# Altium schematic sheet Sheet1.SchDoc
size A2; SheetNumber: 1; SheetTotal: 1
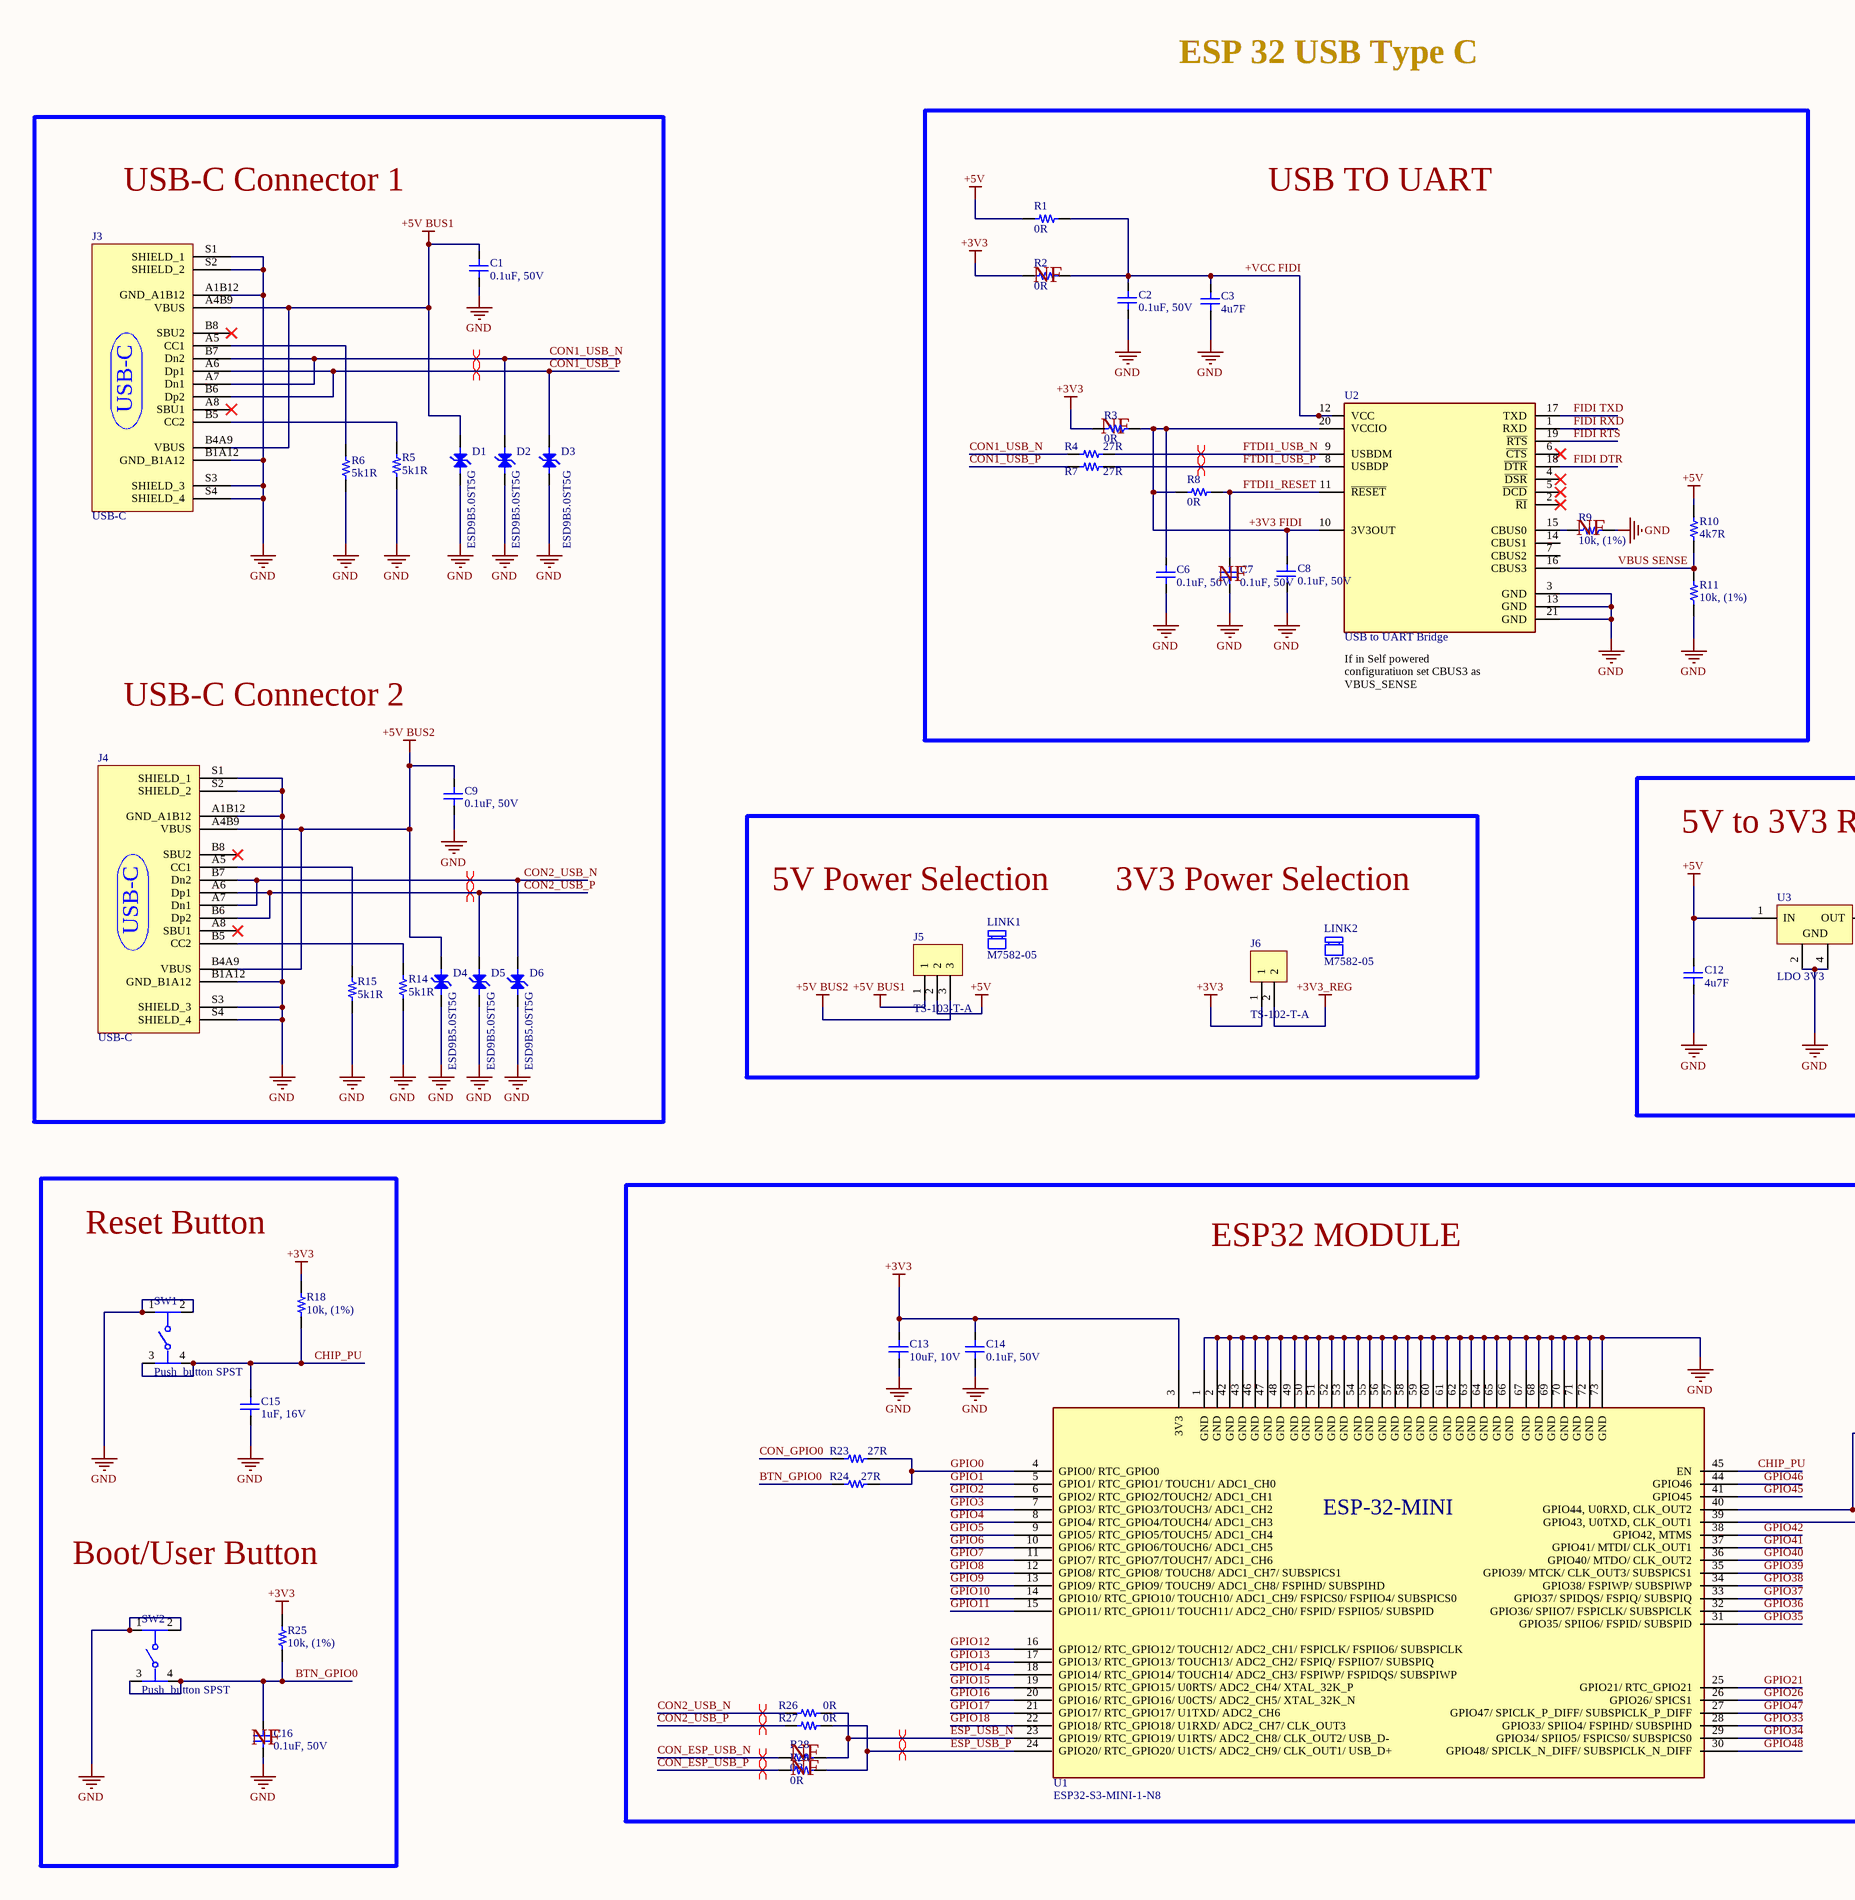
[diagram p0: Sheet1.SchDoc, left]
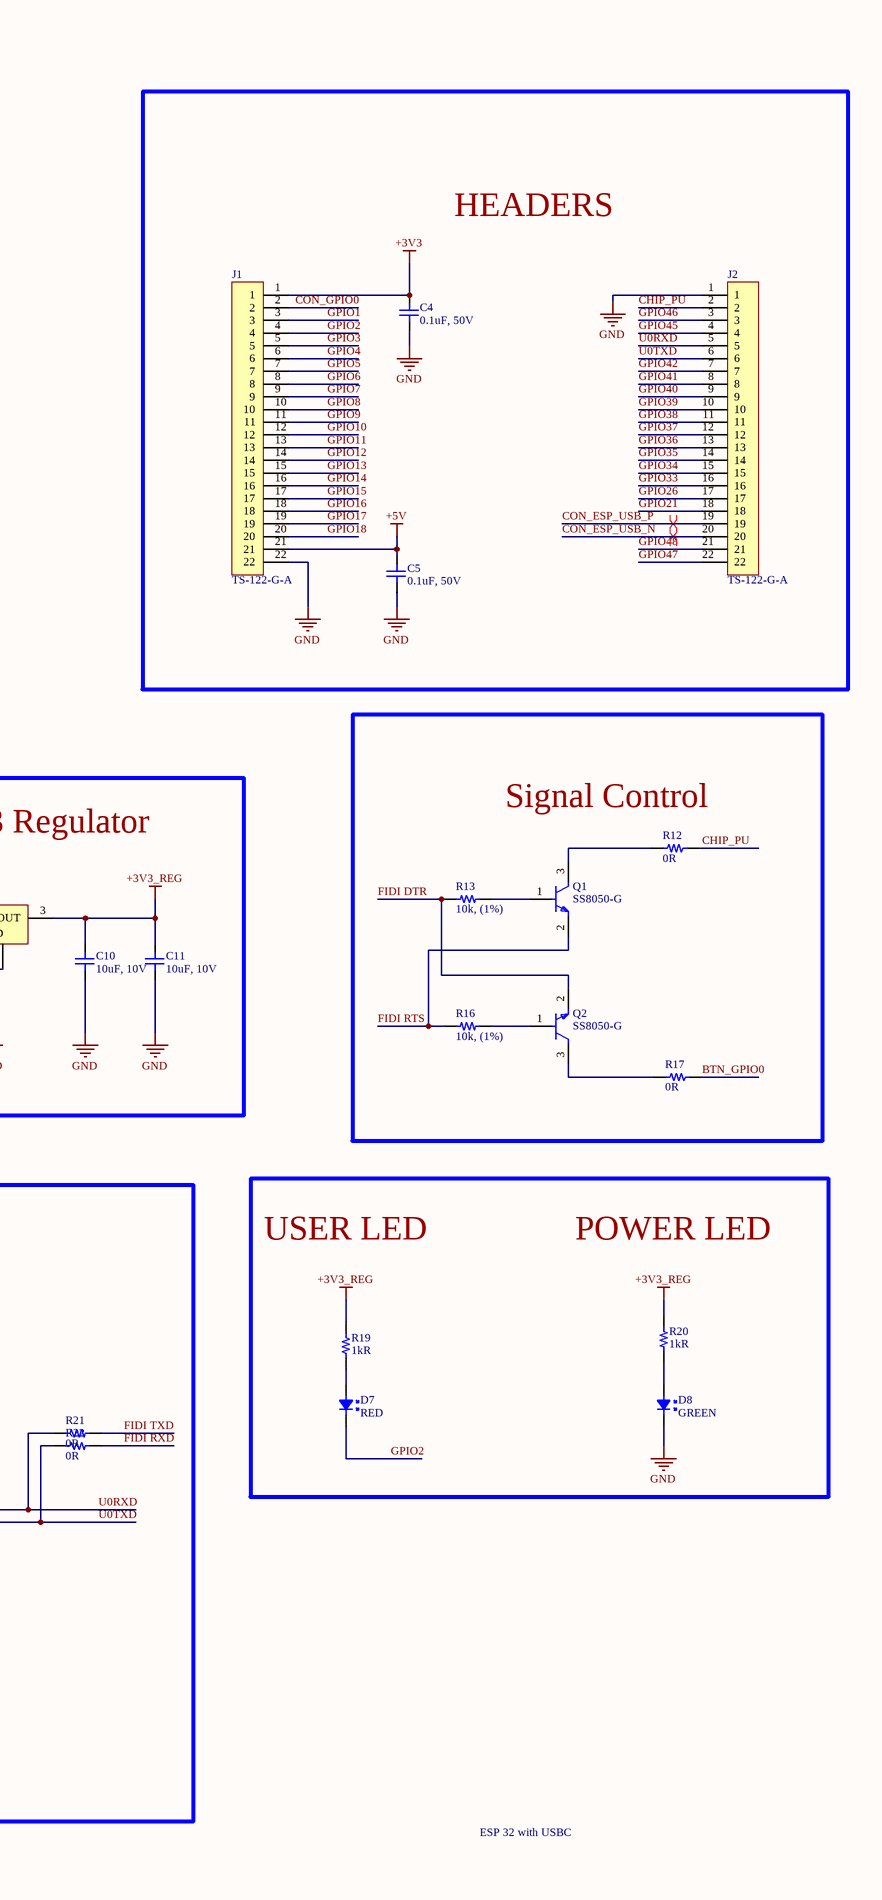
[diagram p1: Sheet1.SchDoc, right]

## Parts
C1  0.1uF, 50V  [FP-CL599-IPC_B]
C2  0.1uF, 50V  [FP-CL599-IPC_B]
C3  4u7F  [FP-CL599-IPC_B]
C4  0.1uF, 50V  [FP-CL599-IPC_B]
C5  0.1uF, 50V  [FP-CL599-IPC_B]
C6  0.1uF, 50V  [FP-CL599-IPC_B]
C7  0.1uF, 50V  [FP-CL599-IPC_B]
C8  0.1uF, 50V  [FP-CL599-IPC_B]
C9  0.1uF, 50V  [FP-CL599-IPC_B]
C10  10uF, 10V  [FP-CL599-IPC_B]
C11  10uF, 10V  [FP-CL599-IPC_B]
C12  4u7F  [FP-CL599-IPC_B]
C13  10uF, 10V  [FP-CL599-IPC_B]
C14  0.1uF, 50V  [FP-CL599-IPC_B]
C15  1uF, 16V  [FP-CL599-IPC_B]
C16  0.1uF, 50V  [FP-CL599-IPC_B]
D1  ESD9B5.0ST5G  [ONSC-SOD-923-2-514AB-01_V]
D2  ESD9B5.0ST5G  [ONSC-SOD-923-2-514AB-01_V]
D3  ESD9B5.0ST5G  [ONSC-SOD-923-2-514AB-01_V]
D4  ESD9B5.0ST5G  [ONSC-SOD-923-2-514AB-01_V]
D5  ESD9B5.0ST5G  [ONSC-SOD-923-2-514AB-01_V]
D6  ESD9B5.0ST5G  [ONSC-SOD-923-2-514AB-01_V]
D7  RED  [LED-RED-0402]
D8  GREEN  [LED-GREEN-0402]
J1  TS-122-G-A  [HDR_1x22_2.54MM]
J2  TS-122-G-A  [HDR_1x22_2.54MM]
J3  USB-C  [FP-2171790001-MFG]
J4  USB-C  [FP-2171790001-MFG]
J5  TS-103-T-A  [HDR_1x3_2.54MM]
J6  TS-102-T-A  [HDR_1x2_2.54MM]
LINK1  M7582-05  (mechanical)
LINK2  M7582-05  (mechanical)
Q1  SS8050-G  [FP-SS8050-G-IPC_B]
Q2  SS8050-G  [FP-SS8050-G-IPC_B]
R1  0R  [RESC1005X40X25NL05T10]
R2  0R  [RESC1005X40X25NL05T10]
R3  0R  [RESC1005X40X25NL05T10]
R4  27R  [RESC1005X40X25NL05T10]
R5  5k1R  [RESC1005X40X25NL05T10]
R6  5k1R  [RESC1005X40X25NL05T10]
R7  27R  [RESC1005X40X25NL05T10]
R8  0R  [RESC1005X40X25NL05T10]
R9  10k, (1%)  [RESC1005X40X25NL05T10]
R10  4k7R  [RESC1005X40X25NL05T10]
R11  10k, (1%)  [RESC1005X40X25NL05T10]
R12  0R  [RESC1005X40X25NL05T10]
R13  10k, (1%)  [RESC1005X40X25NL05T10]
R14  5k1R  [RESC1005X40X25NL05T10]
R15  5k1R  [RESC1005X40X25NL05T10]
R16  10k, (1%)  [RESC1005X40X25NL05T10]
R17  0R  [RESC1005X40X25NL05T10]
R18  10k, (1%)  [RESC1005X40X25NL05T10]
R19  1kR  [RESC1005X40X25NL05T10]
R20  1kR  [RESC1005X40X25NL05T10]
R21  0R  [RESC1005X40X25NL05T10]
R22  0R  [RESC1005X40X25NL05T10]
R23  27R  [RESC1005X40X25NL05T10]
R24  27R  [RESC1005X40X25NL05T10]
R25  10k, (1%)  [RESC1005X40X25NL05T10]
R26  0R  [RESC1005X40X25NL05T10]
R27  0R  [RESC1005X40X25NL05T10]
R28  0R  [RESC1005X40X25NL05T10]
R29  0R  [RESC1005X40X25NL05T10]
SW1  Push  button SPST  [FP-PTS645SH50SMTR92LFS-MFG]
SW2  Push  button SPST  [FP-PTS645SH50SMTR92LFS-MFG]
U1  ESP32-S3-MINI-1-N8  [XCVR_ESP32-S3-MINI-1-N8]
U2  USB to UART Bridge  [FP-QFN-20-IPC_B]
U3  LDO 3V3  [DCY0004A_N]

## Blocks framed on the sheet
USB TO UART: C2 C3 C6-C8 R1-R4 R7-R11 U2
HEADERS: C4 C5 J1 J2
Signal Control: Q1 Q2 R12 R13 R16 R17
5V to 3V3 Regulator: C10-C12 U3
ESP32 MODULE: C13 C14 R21-R24 R26-R29 U1

## Nets
+3V3: C4.2 C13.2 C14.2 J1.1 J6.1 R2.1 R3.1 R18.2 R25.2 U1.3(3V3)
+3V3_REG: C10.2 C11.2 J6.2 R19.2 R20.2 U3.3(OUT)
+5V: C5.2 C12.2 J1.21 J5.2 R1.1 R10.2 U3.1(IN)
+5V BUS1: C1.2 D1.2 J3.A4B9(VBUS) J3.B4A9(VBUS) J5.1
+5V BUS2: C9.2 D4.2 J4.A4B9(VBUS) J4.B4A9(VBUS) J5.3
GND: C1.1 C2.1 C3.1 C4.1 C5.1 C6.1 C7.1 C8.1 C9.1 C10.1 C11.1 C12.1 C13.1 C14.1 C15.1 C16.1 D1.1 D2.1 D3.1 D4.1 D5.1 D6.1 D8.2 J1.22 J2.1 J3.A1B12(GND_A1B12) J3.B1A12(GND_B1A12) J3.S1(SHIELD_1) J3.S2(SHIELD_2) J3.S3(SHIELD_3) J3.S4(SHIELD_4) J4.A1B12(GND_A1B12) J4.B1A12(GND_B1A12) J4.S1(SHIELD_1) J4.S2(SHIELD_2) J4.S3(SHIELD_3) J4.S4(SHIELD_4) R5.1 R6.1 R9.2 R11.1 R14.1 R15.1 SW1.1 SW1.2 SW2.1 SW2.2 U1.1(GND) U1.2(GND) U1.42(GND) U1.43(GND) U1.46(GND) U1.47(GND) U1.48(GND) U1.49(GND) U1.50(GND) U1.51(GND) U1.52(GND) U1.53(GND) U1.54(GND) U1.55(GND) U1.56(GND) U1.57(GND) U1.58(GND) U1.59(GND) U1.60(GND) U1.61(GND) U1.62(GND) U1.63(GND) U1.64(GND) U1.65(GND) U1.66(GND) U1.67(GND) U1.68(GND) U1.69(GND) U1.70(GND) U1.71(GND) U1.72(GND) U1.73(GND) U2.3(GND) U2.13(GND) U2.21(GND) U3.2(GND) U3.4(GND)
+3V3 FIDI: C6.2 C8.2 R3.2 R8.1 U2.10(3V3OUT) U2.20(VCCIO)
+VCC FIDI: C2.2 C3.2 R1.2 R2.2 U2.12(VCC)
BTN_GPIO0: C16.2 R17.2 R24.1 R25.1 SW2.3 SW2.4
CHIP_PU: C15.2 J2.2 R12.2 R18.1 SW1.3 SW1.4 U1.45(EN)
CON1_USB_N: D2.2 J3.A7(Dn1) J3.B7(Dn2) R4.1
CON1_USB_P: D3.2 J3.A6(Dp1) J3.B6(Dp2) R7.1
CON2_USB_N: D6.2 J4.A7(Dn1) J4.B7(Dn2) R26.1
CON2_USB_P: D5.2 J4.A6(Dp1) J4.B6(Dp2) R27.1
CON_ESP_USB_N: J2.20 R28.1
CON_ESP_USB_P: J2.19 R29.1
CON_GPIO0: J1.2 R23.1
ESP_USB_N: R26.2 R28.2 U1.23(GPIO19/_RTC_GPIO19/_U1RTS/_ADC2_CH8/_CLK_OUT2/_USB_D-)
ESP_USB_P: R27.2 R29.2 U1.24(GPIO20/_RTC_GPIO20/_U1CTS/_ADC2_CH9/_CLK_OUT1/_USB_D+)
FIDI DTR: Q2.2(E) R13.1 U2.18(~{DTR})
FIDI RTS: Q1.2(E) R16.1 U2.19(~{RTS})
FIDI RXD: R22.2 U2.1(RXD)
FIDI TXD: R21.2 U2.17(TXD)
FTDI1_RESET: C7.2 R8.2 U2.11(~{RESET})
FTDI1_USB_N: R4.2 U2.9(USBDM)
FTDI1_USB_P: R7.2 U2.8(USBDP)
GPIO0: R23.2 R24.2 U1.4(GPIO0/_RTC_GPIO0)
GPIO1: J1.3 U1.5(GPIO1/_RTC_GPIO1/_TOUCH1/_ADC1_CH0)
GPIO2: D7.2 J1.4 U1.6(GPIO2/_RTC_GPIO2/TOUCH2/_ADC1_CH1)
GPIO3: J1.5 U1.7(GPIO3/_RTC_GPIO3/TOUCH3/_ADC1_CH2)
GPIO4: J1.6 U1.8(GPIO4/_RTC_GPIO4/TOUCH4/_ADC1_CH3)
GPIO5: J1.7 U1.9(GPIO5/_RTC_GPIO5/TOUCH5/_ADC1_CH4)
GPIO6: J1.8 U1.10(GPIO6/_RTC_GPIO6/TOUCH6/_ADC1_CH5)
GPIO7: J1.9 U1.11(GPIO7/_RTC_GPIO7/TOUCH7/_ADC1_CH6)
GPIO8: J1.10 U1.12(GPIO8/_RTC_GPIO8/_TOUCH8/_ADC1_CH7/_SUBSPICS1)
GPIO9: J1.11 U1.13(GPIO9/_RTC_GPIO9/_TOUCH9/_ADC1_CH8/_FSPIHD/_SUBSPIHD)
GPIO10: J1.12 U1.14(GPIO10/_RTC_GPIO10/_TOUCH10/_ADC1_CH9/_FSPICS0/_FSPIIO4/_SUBSPICS0)
GPIO11: J1.13 U1.15(GPIO11/_RTC_GPIO11/_TOUCH11/_ADC2_CH0/_FSPID/_FSPIIO5/_SUBSPID)
GPIO12: J1.14 U1.16(GPIO12/_RTC_GPIO12/_TOUCH12/_ADC2_CH1/_FSPICLK/_FSPIIO6/_SUBSPICLK)
GPIO13: J1.15 U1.17(GPIO13/_RTC_GPIO13/_TOUCH13/_ADC2_CH2/_FSPIQ/_FSPIIO7/_SUBSPIQ)
GPIO14: J1.16 U1.18(GPIO14/_RTC_GPIO14/_TOUCH14/_ADC2_CH3/_FSPIWP/_FSPIDQS/_SUBSPIWP)
GPIO15: J1.17 U1.19(GPIO15/_RTC_GPIO15/_U0RTS/_ADC2_CH4/_XTAL_32K_P)
GPIO16: J1.18 U1.20(GPIO16/_RTC_GPIO16/_U0CTS/_ADC2_CH5/_XTAL_32K_N)
GPIO17: J1.19 U1.21(GPIO17/_RTC_GPIO17/_U1TXD/_ADC2_CH6)
GPIO18: J1.20 U1.22(GPIO18/_RTC_GPIO18/_U1RXD/_ADC2_CH7/_CLK_OUT3)
GPIO21: J2.18 U1.25(GPIO21/_RTC_GPIO21)
GPIO26: J2.17 U1.26(GPIO26/_SPICS1)
GPIO33: J2.16 U1.28(GPIO33/_SPIIO4/_FSPIHD/_SUBSPIHD)
GPIO34: J2.15 U1.29(GPIO34/_SPIIO5/_FSPICS0/_SUBSPICS0)
GPIO35: J2.14 U1.31(GPIO35/_SPIIO6/_FSPID/_SUBSPID)
GPIO36: J2.13 U1.32(GPIO36/_SPIIO7/_FSPICLK/_SUBSPICLK)
GPIO37: J2.12 U1.33(GPIO37/_SPIDQS/_FSPIQ/_SUBSPIQ)
GPIO38: J2.11 U1.34(GPIO38/_FSPIWP/_SUBSPIWP)
GPIO39: J2.10 U1.35(GPIO39/_MTCK/_CLK_OUT3/_SUBSPICS1)
GPIO40: J2.9 U1.36(GPIO40/_MTDO/_CLK_OUT2)
GPIO41: J2.8 U1.37(GPIO41/_MTDI/_CLK_OUT1)
GPIO42: J2.7 U1.38(GPIO42,_MTMS)
GPIO45: J2.4 U1.41(GPIO45)
GPIO46: J2.3 U1.44(GPIO46)
GPIO47: J2.22 U1.27(GPIO47/_SPICLK_P_DIFF/_SUBSPICLK_P_DIFF)
GPIO48: J2.21 U1.30(GPIO48/_SPICLK_N_DIFF/_SUBSPICLK_N_DIFF)
U0RXD: J2.5 R21.1 U1.40(GPIO44,_U0RXD,_CLK_OUT2)
U0TXD: J2.6 R22.1 U1.39(GPIO43,_U0TXD,_CLK_OUT1)
VBUS SENSE: R10.1 R11.2 U2.16(CBUS3)
NetD7_1: D7.1 R19.1
NetD8_1: D8.1 R20.1
NetJ3_A5: J3.A5(CC1) R6.2
NetJ3_B5: J3.B5(CC2) R5.2
NetJ4_A5: J4.A5(CC1) R15.2
NetJ4_B5: J4.B5(CC2) R14.2
NetQ1_1: Q1.1(B) R13.2
NetQ1_3: Q1.3(C) R12.1
NetQ2_1: Q2.1(B) R16.2
NetQ2_3: Q2.3(C) R17.1
NetR9_1: R9.1 U2.15(CBUS0)

Not connected (* = marked no-connect by the designer): J3 A8(SBU1)* B8(SBU2)*; J4 A8(SBU1)* B8(SBU2)*; U2 2(~{RI})* 4(~{DSR})* 5(~{DCD})* 6(~{CTS})* 7(CBUS2) 14(CBUS1)

## Layout directives
differential pair; differential pair class DIFF90: CON1_USB_N, CON1_USB_P, CON2_USB_N, CON2_USB_P, CON_ESP_USB_N, CON_ESP_USB_P, ESP_USB_N, ESP_USB_P, FTDI1_USB_N, FTDI1_USB_P

## Notes on the sheet
- ESP 32 USB Type C
- USB-C Connector 1
- (near R2) NF
- (near R3) NF
- (near R9) NF
- (near C7) NF
- (near U2) If in Self powered configuratiuon set CBUS3 as VBUS_SENSE
- USB-C Connector 2
- (near LINK1) 5V Power Selection
- (near LINK2) 3V3 Power Selection
- Reset Button
- USER LED
- POWER LED
- Boot/User Button
- (near C16) NF
- NF
- ESP 32 with USBC
- (in symbol ESP32-S3-MINI-1-N8) ESP-32-MINI

## Library data of the parts
C1 C2 C4-C9 C14 C16 = CL05B104KB54PNC: 50V 100nF X7R ±10% 0402 Multilayer Ceramic Capacitors MLCC - SMD/SMT ROHS; Manufacturer: Samsung; Material: 4241ConductorMaterial; Supplier: Digikey; Supplier Part Number: 1276-CL05B104KB54PNCCT-ND; Manufacturer Part Number: CL05B104KB54PNC; RoHS: Yes; Category: Ceramic Capacitors; Stock: 1445745; Pricing: 1=0.1, 10=0.03, 100=0.018, 1000=0.01195, 2500=0.01037, 5000=0.00939 (USD); Case/Package: 343Case; Min Operating Temperature: -55°C; Max Operating Temperature: 125°C; Tolerance: 10%; Voltage Rating: 50V; Value: 100nF; Height: 550um; RoHS Compliant: Yes; LCSC part number: C307331
C3 C12 = CL05A475MP5NRNC: Multilayer Ceramic Capacitor, 4.7 uF, 10 V, ï¿½ 20%, X5R, 0402 [1005 Metric]; Manufacturer: Samsung; Material: 4241ConductorMaterial; Value: 4.7uF; Voltage Rating: 10V; Supplier: Digikey; Supplier Part Number: 1276-1482-1-ND; Manufacturer Part Number: CL05A475MP5NRNC; RoHS: Yes; Category: Ceramic Capacitors; Stock: 1513638; Pricing: 1=0.1, 10=0.04, 100=0.0245, 1000=0.01648, 2500=0.01439, 5000=0.01308 (USD); Mounting Technology: Surface Mount; Case/Package: 0402; Case Code (Metric): 1005; Case Code (Imperial): 0402; Min Operating Temperature: -55°C; Max Operating Temperature: 85°C; Packaging: Cut Tape; Tolerance: 20%; Dielectric: X5R; Series: CL; Height: 550um; Lead Free: Lead Free; RoHS Compliant: Yes; ComponentLink1URL: https://datasheet.ciiva.com/25786/cl05a475mp5nrnc-25786963.pdf?src-supplier=Digikey; ComponentLink1Description: https://datasheet.ciiva.com/25786/cl05a475mp5nrnc-25786963.pdf?src-supplier=Digikey; ComponentLink2URL: https://datasheet.ciiva.com/16437/cl05b104kq5nnnc-16437353.pdf?src-supplier=Future+Electronics; ComponentLink2Description: https://datasheet.ciiva.com/16437/cl05b104kq5nnnc-16437353.pdf?src-supplier=Future+Electronics; LCSC Part number: C23733
C10 C11 C13 = CL05A106MP8NUB8: Multilayer Ceramic Capacitor, 10 uF, 10 V, ± 20%, X5R, 0402 [1005 Metric]; Manufacturer: Samsung; Material: 4241ConductorMaterial; Supplier: Digikey; Supplier Part Number: 1276-6830-1-ND; Manufacturer Part Number: CL05A106MP8NUB8; RoHS: Yes; Category: Ceramic Capacitors; Stock: 179131; Pricing: 1=0.31, 10=0.188, 100=0.1251, 1000=0.09037, 2500=0.08106 (USD); Mounting Technology: Surface Mount; Case/Package: 0402; Case Code (Metric): 1005; Case Code (Imperial): 0402; Min Operating Temperature: -55°C; Max Operating Temperature: 85°C; Packaging: Cut Tape; Value: 10uF; Voltage Rating: 10V; Tolerance: 20%; Series: CL; Length: 0.039inch; Width: 0.02inch; Height: 550um; Thickness: 0.035inch; RoHS Compliant: Yes; ComponentLink1URL: http://www.samsungsem.com/kr/support/product-search/mlcc/CL05A106MP8NUB8.jsp?src-supplier=Digikey; ComponentLink1Description: http://www.samsungsem.com/kr/support/product-search/mlcc/CL05A106MP8NUB8.jsp?src-supplier=Digikey; ComponentLink2URL: https://datasheet.octopart.com/CL05A106MP8NUB8-Samsung-Electro-Mechanics-datasheet-136460857.pdf?src-supplier=Future+Electronics; ComponentLink2Description: https://datasheet.octopart.com/CL05A106MP8NUB8-Samsung-Electro-Mechanics-datasheet-136460857.pdf?src-supplier=Future+Electronics; LCSC Part number: CL05A106MP8NUB8
C15 = CL05A105KO5NNNC: 16V 1uF X5R ±10% 0402 Multilayer Ceramic Capacitors MLCC - SMD/SMT ROHS; Manufacturer: Samsung; Material: 4241ConductorMaterial; Supplier: Digikey; Supplier Part Number: 1276-1067-1-ND; Manufacturer Part Number: CL05A105KO5NNNC; RoHS: Yes; Category: Ceramic Capacitors; Stock: 1549627; Pricing: 1=0.1, 10=0.027, 100=0.0163, 1000=0.01076, 2500=0.00932, 5000=0.00843 (USD); Mounting Technology: Surface Mount; Case/Package: 0402; Case Code (Metric): 1005; Case Code (Imperial): 0402; Min Operating Temperature: -55°C; Max Operating Temperature: 85°C; Packaging: Tape and Reel; Package Quantity: 1; Voltage Rating: 16V; Series: CL; Value: 1uF; Tolerance: 10%; Dielectric: X5R; Voltage: 16V; Construction: Flat; Voltage Rating (DC): 16V; Length: 1mm; Width: 0.02inch; Height: 0.5mm; Thickness: 0.022inch; Depth: 0.5mm; Radiation Hardening: No; RoHS Compliant: Yes; ComponentLink1URL: https://datasheet.ciiva.com/16207/cl05a105ko5nnnc-16207571.pdf?src-supplier=Future+Electronics; ComponentLink1Description: https://datasheet.ciiva.com/16207/cl05a105ko5nnnc-16207571.pdf?src-supplier=Future+Electronics; ComponentLink2URL: https://datasheet.ciiva.com/15195/getdatasheetpartid-355272-15195629.pdf?src-supplier=Verical; ComponentLink2Description: https://datasheet.ciiva.com/15195/getdatasheetpartid-355272-15195629.pdf?src-supplier=Verical; LCSC part number: C29266
D1-D6 = ESD9B5.0ST5G: ESD Suppressor TVS Single Bi-Dir ±18kV@Air Gap/±18kV@Contact Disc 2-Pin SOD-923 T/R; Manufacturer: ON Semiconductor; Direction: Bidirectional; Number of Bidirectional Channels: 1; Reverse Standoff Voltage: 5V; Min Breakdown Voltage: 5.8V; Power Line Protection: No; Peak Pulse Current: 1A; Diode Type: ZENER; Value: 15pF; Clamping Voltage: 12.5V; Max Power Dissipation: 300mW; Leakage Current: 1uA; Test Current: 1mA; ESD Protection: Yes; Max Breakdown Voltage: 7.8V; Supplier: Digikey; Supplier Part Number: ESD9B5.0ST5GOSCT-ND; Manufacturer Part Number: ESD9B5.0ST5G; RoHS: Yes; Category: ESD and Circuit Protection ICs; Stock: 1217500; Pricing: 1=0.1, 10=0.071, 100=0.033, 500=0.031, 1000=0.029 (USD); Case/Package: SOD-923-2; Pins: 2; Min Operating Temperature: -55°C; Max Operating Temperature: 150°C; Packaging: Tape and Reel; Number of Lines: 1; Series: Automotive, AEC-Q101; Reverse Breakdown Voltage: 5.8V; Number of Channels: 1; Number of Elements: 1; Package Quantity: 1; Operating Supply Voltage: 5V; Max Surge Current: 1A; Breakdown Voltage: 5.8V; Polarity: Bidirectional; Termination: SMD/SMT; Working Voltage: 5V; Peak Pulse Power: 300mW; Max Reverse Leakage Current: 1uA; Clamping Voltage-Max: 12.5V; Length: 0.8mm; Width: 0.65mm; Height: 0.4mm; Depth: 0.6mm; Radiation Hardening: No; Lead Free: Lead Free; Halogen Free: Halogen Free; RoHS Compliant: Yes; Reach SVHC Compliant: No; ComponentLink1URL: https://datasheet.ciiva.com/1219/1596367-1219274.pdf?src-supplier=Newark; ComponentLink1Description: https://datasheet.ciiva.com/1219/1596367-1219274.pdf?src-supplier=Newark; LCSC Part Number: C316040
D7 = VLMS1500-GS08: LED RED 0402 SMD; Manufacturer: Vishay; Viewing Angle: 130°; Forward Current: 30mA; Forward Voltage: 2V; Luminous Intensity: 54mcd; Dominant Wavelength: 631nm; Test Current: 20mA; Lens Style: Flat,Rectangular,Square; Number of LEDs: 1; Power Rating: 75mW; Lens Size: 0.5mm; Supplier: Digikey; Supplier Part Number: VLMS1500-GS08CT-ND; Manufacturer Part Number: VLMS1500-GS08; RoHS: Yes; Category: LEDs; Stock: 72955; Pricing: 1=0.33, 10=0.189, 100=0.1166, 500=0.08838, 1000=0.07977 (USD); Mounting Technology: Surface Mount; Case/Package: 0402; Pins: 2; Color: Red; Case Code (Metric): 1005; Case Code (Imperial): 0402; Min Operating Temperature: -30°C; Max Operating Temperature: 85°C; Package Quantity: 9000; Packaging: Tape and Reel; Illumination Color: Red; Wavelength: 631nm; Series: CHipLED; Length: 1mm; Width: 0.5mm; Height: 0.55mm; Radiation Hardening: No; Lead Free: Lead Free; RoHS Compliant: Yes; Reach SVHC Compliant: Unknown; ComponentLink1URL: http://components.arrow.com/part/dataview/56357384S461524N5680?src-supplier=Arrow+Electronics; ComponentLink1Description: http://components.arrow.com/part/dataview/56357384S461524N5680?src-supplier=Arrow+Electronics; ComponentLink2URL: http://www.mouser.com/ds/2/427/vlmo1500-244705.pdf?src-supplier=Mouser; ComponentLink2Description: http://www.mouser.com/ds/2/427/vlmo1500-244705.pdf?src-supplier=Mouser; ComponentLink3URL: http://www.farnell.com/datasheets/1809983.pdf?src-supplier=Farnell; ComponentLink3Description: http://www.farnell.com/datasheets/1809983.pdf?src-supplier=Farnell; ComponentLink4URL: http://www.alliedelec.com/m/d/cfc385e1097fc985ee9a50a3551ac188.pdf?src-supplier=Allied+Electronics; ComponentLink4Description: http://www.alliedelec.com/m/d/cfc385e1097fc985ee9a50a3551ac188.pdf?src-supplier=Allied+Electronics; ComponentLink5URL: https://datasheet.octopart.com/VLMS1500-GS08-Vishay-datasheet-62332426.pdf?src-supplier=Newark; ComponentLink5Description: https://datasheet.octopart.com/VLMS1500-GS08-Vishay-datasheet-62332426.pdf?src-supplier=Newark; ComponentLink6URL: http://www.vishay.com/docs/82554/vlmo1500.pdf?src-supplier=Avnet; ComponentLink6Description: http://www.vishay.com/docs/82554/vlmo1500.pdf?src-supplier=Avnet; ComponentLink7URL: https://datasheet.octopart.com/VLMS1500-GS08-Vishay-datasheet-21227148.pdf?src-supplier=Future+Electronics; ComponentLink7Description: https://datasheet.octopart.com/VLMS1500-GS08-Vishay-datasheet-21227148.pdf?src-supplier=Future+Electronics; ComponentLink8URL: http://www.farnell.com/datasheets/2050839.pdf?src-supplier=Newark; ComponentLink8Description: http://www.farnell.com/datasheets/2050839.pdf?src-supplier=Newark; ComponentLink9URL: http://www.farnell.com/datasheets/1809983.pdf?src-supplier=Element14; ComponentLink9Description: http://www.farnell.com/datasheets/1809983.pdf?src-supplier=Element14; ComponentLink10URL: https://datasheet.octopart.com/VLMS1500-GS08-Vishay-datasheet-33014519.pdf?src-supplier=Element14; ComponentLink10Description: https://datasheet.octopart.com/VLMS1500-GS08-Vishay-datasheet-33014519.pdf?src-supplier=Element14; ComponentLink11URL: http://www.farnell.com/datasheets/1809983.pdf?src-supplier=Newark; ComponentLink11Description: http://www.farnell.com/datasheets/1809983.pdf?src-supplier=Newark; ComponentLink12URL: http://datasheet.octopart.com/VLMS1500-GS08-Vishay-datasheet-21227148.pdf?src-supplier=Avnet; ComponentLink12Description: http://datasheet.octopart.com/VLMS1500-GS08-Vishay-datasheet-21227148.pdf?src-supplier=Avnet; ComponentLink13URL: http://datasheet.octopart.com/VLMS1500-GS08-Vishay-datasheet-21227148.pdf?src-supplier=LCSC; ComponentLink13Description: http://datasheet.octopart.com/VLMS1500-GS08-Vishay-datasheet-21227148.pdf?src-supplier=LCSC; ComponentLink14URL: http://datasheet.octopart.com/VLMS1500-GS08-Vishay-datasheet-21227148.pdf?src-supplier=Quest; ComponentLink14Description: http://datasheet.octopart.com/VLMS1500-GS08-Vishay-datasheet-21227148.pdf?src-supplier=Quest; ComponentLink15URL: http://datasheet.octopart.com/VLMS1500-GS08-Vishay-datasheet-21227148.pdf?src-supplier=NAC+Semi; ComponentLink15Description: http://datasheet.octopart.com/VLMS1500-GS08-Vishay-datasheet-21227148.pdf?src-supplier=NAC+Semi; LCSC Part Number: C511370
D8 = VLMTG1500-GS08: LED GREEN 0402 SMD; Manufacturer: Vishay; Viewing Angle: 65°; Supplier: Digikey; Supplier Part Number: 751-VLMTG1500-GS08DKR-ND; Manufacturer Part Number: VLMTG1500-GS08; RoHS: Yes; Category: LEDs; Stock: 2572; Pricing: 1=0.43, 10=0.249, 100=0.1568, 500=0.12086, 1000=0.10985 (USD); RoHS Compliant: Yes; LCSC Part Number: C20346084
J1 J2 = TS-122-G-A: 22 Position Header Connector Post Gold; Manufacturer: Samtec; Supplier: Mouser; Supplier Part Number: 200-TS122GA; Manufacturer Part Number: TS-122-G-A; RoHS: Yes; Category: Connectors; Stock: 20; Pricing: 1=5.24, 10=5.24, 50=5.24, 100=4.19, 1000=3.03, 10000=2.45 (USD); ComponentLink1URL: https://datasheet.ciiva.com/410/tx-1xx-x-x-mkt1-410311.pdf?src-supplier=Digikey; ComponentLink1Description: https://datasheet.ciiva.com/410/tx-1xx-x-x-mkt1-410311.pdf?src-supplier=Digikey; LCSC Part number: C7125323
J3 J4 = 217179-0001: CONN RCP USB2.0 TYP C 24P SMD RA; Manufacturer: Molex; Current Rating: 1.25A; Gender: Receptacle; Number of Contacts: 16; Voltage Rating: 30V; Supplier: Digikey; Supplier Part Number: 900-2171790001CT-ND; Manufacturer Part Number: 217179-0001; RoHS: No; Category: Connectors; Stock: 2736; Pricing: 1=0.79, 10=0.645, 25=0.5948, 50=0.5594, 100=0.5259, 250=0.48484, 500=0.45592 (USD); Contact Material: Nickel,Gold; Min Operating Temperature: -40°C; Max Operating Temperature: 85°C; USB Standard: USB 2.0; Height: 3.36mm; LCSC Part number: C2894899
J5 = TS-103-T-A: CONN HEADER VERT 3POS 2.54MM; Manufacturer: Samtec; Supplier: Digikey; Supplier Part Number: SAM1112-03-ND; Manufacturer Part Number: TS-103-T-A; RoHS: Yes; Category: Connectors; Stock: 9448; Pricing: 1=0.9, 10=0.734, 100=0.5984, 500=0.51874, 1000=0.48782, 5000=0.42299, 10000=0.42149 (USD); ComponentLink1URL: https://datasheet.ciiva.com/410/tx-1xx-x-x-mkt1-410199.pdf?src-supplier=Digikey; ComponentLink1Description: https://datasheet.ciiva.com/410/tx-1xx-x-x-mkt1-410199.pdf?src-supplier=Digikey; LCSC Part number: C6338633
J6 = TS-102-T-A: CONN HEADER VERT 2POS 2.54MM; Manufacturer: Samtec; Gender: 29Gender; Supplier: Digikey; Supplier Part Number: SAM1112-02-ND; Manufacturer Part Number: TS-102-T-A; RoHS: Yes; Category: Headers and Wire Housings; Stock: 6682; Pricing: 1=0.71, 10=0.575, 100=0.4687, 500=0.4063, 1000=0.38208, 5000=0.3313, 10000=0.32266 (USD); Width: 2.54mm; Lead Free: 5697LeadFree; ComponentLink1URL: https://datasheet.ciiva.com/410/tx-1xx-x-x-mkt1-410198.pdf?src-supplier=Digikey; ComponentLink1Description: https://datasheet.ciiva.com/410/tx-1xx-x-x-mkt1-410198.pdf?src-supplier=Digikey; LCSC Part number: C3337950
LINK1 LINK2 = M7582-05: 2.54mm (0.1") Pitch Open Top Jumper Socket, single use, gold, Black; Manufacturer: Harwin; Max Current Rating: 1A; Contact Resistance: 20mR; Number of Positions: 2; Insulation Resistance: 5GR; Supplier: Digikey; Supplier Part Number: 952-2881-ND; Manufacturer Part Number: M7582-05; RoHS: Yes; Category: Headers and Wire Housings; Stock: 29899; Pricing: 1=0.15, 10=0.124, 25=0.114, 50=0.107, 100=0.1007, 250=0.0928, 500=0.08728, 1000=0.08207, 2500=0.07566 (USD); Contact Material: Bronze; Contact Plating: Gold; Color: Black; Material: Nickel; Plating: Gold; Housing Color: Black; Housing Material: PBT; Min Operating Temperature: -55°C; Max Operating Temperature: 105°C; Package Quantity: 5000; Packaging: Bulk; Series: M75; Number of Rows: 1; Contact Gender: Female; Current Rating: 1A; Number of Contacts: 2; Orientation: Straight; Length: 5mm; Height: 0.236inch; Depth: 2.4mm; Pitch: 2.54mm; Radiation Hardening: No; RoHS Compliant: Yes; Flammability Rating: UL94 V-0; ComponentLink1URL: https://datasheet.ciiva.com/15174/getdatasheetpartid-412516-15174987.pdf?src-supplier=Verical; ComponentLink1Description: https://datasheet.ciiva.com/15174/getdatasheetpartid-412516-15174987.pdf?src-supplier=Verical; LCSC Part number: C3715643
Q1 Q2 = SS8050-G: TRANS NPN 25V 1.5A SOT-23-3; Manufacturer: Comchip; Max Power Dissipation: 300mW; Transition Frequency: 100MHz; Collector-emitter Voltage-Max: 400mV; Collector Base Voltage (VCBO): 40V; Collector Emitter Saturation Voltage: 500mV; Emitter Base Voltage (VEBO): 5V; hFE Min: 200; Number of Elements: 1; Supplier: Digikey; Supplier Part Number: 641-1790-1-ND; Manufacturer Part Number: SS8050-G; RoHS: Yes; Category: Transistors; Stock: 104442; Pricing: 1=0.24, 10=0.148, 100=0.0921, 500=0.06754, 1000=0.05958 (USD); Mounting Technology: Surface Mount; Case/Package: TO-236-3; Max Operating Temperature: 150°C; Packaging: Cut Tape; Max Collector Current: 1.5A; Collector Emitter Breakdown Voltage: 25V; Max Breakdown Voltage: 25V; Series: -; Power Dissipation: 300mW; Height: 1.15mm; RoHS Compliant: Yes; ComponentLink1URL: http://www.comchiptech.com/admin/files/product/SS8050-G RevA181526.pdf?src-supplier=Digikey; ComponentLink1Description: http://www.comchiptech.com/admin/files/product/SS8050-G RevA181526.pdf?src-supplier=Digikey; LCSC Part number: C164886
R1-R3 R8 R12 R17 R21 R22 R26-R29 = RC0402FR-070RL: 62.5mW Thick Film Resistors 50V ±5% 0Ω 0402 Chip Resistor - Surface Mount ROHS; Manufacturer: Yageo; Tolerance: 1%; Temperature Coefficient: 200ppm/°C; Max Power Dissipation: 63mW; Supplier: Digikey; Supplier Part Number: 311-0.0LRCT-ND; Manufacturer Part Number: RC0402FR-070RL; RoHS: Yes; Category: Chip SMD Resistors; Stock: 1505938; Pricing: 1=0.1, 10=0.002 (USD); Mounting Technology: Surface Mount; Case/Package: 0402; Contact Plating: Tin,Matte; Case Code (Imperial): 0402; Case Code (Metric): 1005; Min Operating Temperature: -55°C; Max Operating Temperature: 155°C; Value: 0R; Power Rating: 62.5mW; Packaging: Tape and Reel; Voltage Rating: 50V; Termination: SMD/SMT; Features: Moisture Resistant; Series: RC; Number of Terminations: 2; Length: 1mm; Width: 0.5mm; Height: 0.35mm; Lead Free: 5697LeadFree; RoHS Compliant: Yes; LCSC Part number: C60485
R4 R7 R23 R24 = RC0402FR-0727RL: 62.5mW 27Ω 50V ±1% ±100ppm/℃ Thick Film Resistors 0402 Chip Resistor - Surface Mount ROHS; Manufacturer: Yageo; Temperature Coefficient: 100ppm/°C; Max Power Dissipation: 63mW; Supplier: Digikey; Supplier Part Number: YAG3086CT-ND; Manufacturer Part Number: RC0402FR-0727RL; RoHS: Yes; Category: Chip SMD Resistors; Stock: 352788; Pricing: 1=0.1, 10=0.007, 100=0.0056, 1000=0.00408, 2500=0.00357 (USD); Case/Package: 0402; Case Code (Imperial): 0402; Case Code (Metric): 1005; Weight: 2.3E-05oz; Min Operating Temperature: -55°C; Max Operating Temperature: 155°C; Value: 27R; Tolerance: 1%; Packaging: Tape and Reel; Power Rating: 62.5mW; Voltage Rating: 50V; Resistor Type: Thick Film; Termination: SMD/SMT; Number of Terminations: 2; Features: Moisture Resistant; Series: RC; Construction: Rectangular; Technology: THICK FILM; Resistance Tolerance: 1%; Voltage Rating (AC): 50V; Length: 1mm; Width: 0.5mm; Height: 0.016inch; Depth: 0.5mm; Military Standard: Not; Lead Free: Lead Free; RoHS Compliant: Yes; Reach SVHC Compliant: Unknown; ComponentLink1URL: https://datasheet.ciiva.com/11808/0900766b80c66297-11808450.pdf?src-supplier=Rs; ComponentLink1Description: https://datasheet.ciiva.com/11808/0900766b80c66297-11808450.pdf?src-supplier=Rs; ComponentLink2URL: https://datasheet.ciiva.com/17044/pyu-rc0402-51-rohs-l-6-17044345.pdf?src-supplier=Future+Electronics; ComponentLink2Description: https://datasheet.ciiva.com/17044/pyu-rc0402-51-rohs-l-6-17044345.pdf?src-supplier=Future+Electronics; ComponentLink3URL: https://datasheet.ciiva.com/7849/1018594-7849927.pdf?src-supplier=Element14; ComponentLink3Description: https://datasheet.ciiva.com/7849/1018594-7849927.pdf?src-supplier=Element14; ComponentLink4URL: https://datasheet.ciiva.com/7849/1018594-7849926.pdf?src-supplier=Element14; ComponentLink4Description: https://datasheet.ciiva.com/7849/1018594-7849926.pdf?src-supplier=Element14; LCSC Part number: C138021
R5 R6 R14 R15 = RC0402FR-075K1L: RES 5.1K OHM 1% 1/16W 0402; Manufacturer: Yageo; Power Rating: 63mW; Voltage Rating: 50V; Value: 5.1kR; Temperature Coefficient: 100ppm/°C; Parameter 1: C105872; Supplier: Digikey; Supplier Part Number: 311-5.10KLRCT-ND; Manufacturer Part Number: RC0402FR-075K1L; RoHS: Yes; Category: Chip SMD Resistors; Stock: 229144; Pricing: 1=0.1, 10=0.008, 100=0.0066, 1000=0.0051, 2500=0.00459, 5000=0.00408 (USD); Case/Package: 0402; Case Code (Metric): 1005; Case Code (Imperial): 0402; Min Operating Temperature: -55°C; Max Operating Temperature: 155°C; Tolerance: 1%; Packaging: Tape and Reel; Package Quantity: 1; Resistor Type: Thick Film; Number of Terminations: 2; Termination: SMD/SMT; Max Power Dissipation: 63mW; Features: Moisture Resistant; Series: RC; Resistance Tolerance: 1%; Technology: THICK FILM; Voltage Rating (DC): 50V; Working Voltage: 50V; Construction: Rectangular; Length: 1mm; Width: 0.02inch; Height: 0.016inch; Depth: 0.5mm; RoHS Compliant: Yes; Reach SVHC Compliant: Unknown; Lead Free: 5697LeadFree; Military Standard: Not
R9 R11 R13 R16 R18 R25 = AC0402FR-0710KL: SMD Chip Resistor, 10 kOhm, ï¿½ 1%, 62.5 mW, 0402 [1005 Metric], Thick Film, General Purpose; Manufacturer: Yageo; Value: 10kR; Power Rating: 62.5mW; Voltage Rating: 50V; Temperature Coefficient: 100ppm/°C; Max Power Dissipation: 63mW; Supplier: Digikey; Supplier Part Number: YAG3436CT-ND; Manufacturer Part Number: AC0402FR-0710KL; RoHS: Yes; Category: Chip SMD Resistors; Stock: 801477; Pricing: 1=0.1, 10=0.009, 100=0.0082, 1000=0.00714, 2500=0.00612, 5000=0.0051 (USD); Case/Package: 0402; Case Code (Imperial): 0402; Case Code (Metric): 1005; Min Operating Temperature: -55°C; Max Operating Temperature: 155°C; Tolerance: 1%; Packaging: Tape and Reel; Termination: SMD/SMT; Number of Terminations: 2; Features: Moisture Resistant,Automotive AEC-Q200; Series: AC; Length: 0.039inch; Width: 0.02inch; Height: 0.015inch; Lead Free: Lead Free; RoHS Compliant: Yes; ComponentLink1URL: https://datasheet.ciiva.com/12656/pyu-ac-51-rohs-l-2-12656634.pdf?src-supplier=Mouser; ComponentLink1Description: https://datasheet.ciiva.com/12656/pyu-ac-51-rohs-l-2-12656634.pdf?src-supplier=Mouser; LCSC part number: C144807
R10 = RC0402JR-074K7L: RES 4.7K OHM 5% 1/16W 0402; Manufacturer: Yageo; Voltage Rating (AC): 50V; Value: 4.7kR; Power Rating: 62.5mW; Temperature Coefficient: 100ppm/°C; Max Power Dissipation: 63mW; Supplier: Digikey; Supplier Part Number: 311-4.7KJRCT-ND; Manufacturer Part Number: RC0402JR-074K7L; RoHS: Yes; Category: Chip SMD Resistors; Stock: 17282127; Pricing: 1=0.1, 10=0.007, 50=0.0056, 100=0.0041, 500=0.00356, 1000=0.0025 (USD); Case/Package: 0402; Case Code (Imperial): 0402; Case Code (Metric): 1005; Min Operating Temperature: -55°C; Max Operating Temperature: 155°C; Voltage Rating: 50V; Tolerance: 5%; Packaging: Tape and Reel; Package Quantity: 1; Termination: SMD/SMT; Resistor Type: Thick Film; Number of Terminations: 2; Features: Moisture Resistant; Series: RC; Resistance Tolerance: 5%; Length: 0.039inch; Width: 0.02inch; Height: 0.016inch; Lead Free: Lead Free; Reach SVHC Compliant: No; RoHS Compliant: Yes; LCSC Part number: C105870
R19 R20 = RC0402JR-071KL: RES 1K OHM 5% 1/16W 0402; Manufacturer: Yageo; Voltage Rating: 50V; Power Rating: 62.5mW; Temperature Coefficient: 100ppm/°C; Max Power Dissipation: 63mW; Supplier: Digikey; Supplier Part Number: 311-1.0KJRCT-ND; Manufacturer Part Number: RC0402JR-071KL; RoHS: Yes; Category: Chip SMD Resistors; Stock: 11901828; Pricing: 1=0.1, 10=0.008, 50=0.0072, 100=0.0061, 500=0.0056, 1000=0.0051, 5000=0.00408 (USD); Case/Package: 0402; Case Code (Imperial): 0402; Case Code (Metric): 1005; Min Operating Temperature: -55°C; Max Operating Temperature: 155°C; Packaging: Cut Tape; Termination: SMD/SMT; Series: RC; Voltage Rating (AC): 50V; Value: 1kR; Tolerance: 5%; Package Quantity: 1; Resistor Type: Thick Film; Number of Terminations: 2; Features: Moisture Resistant; Resistance Tolerance: 5%; Length: 0.039inch; Width: 0.02inch; Height: 0.016inch; Reach SVHC Compliant: No; Lead Free: 5697LeadFree; RoHS Compliant: Yes; LCSC Part Number: C105637
SW1 SW2 = PTS645SH50SMTR92LFS: 6mm 5mm Round Button 50mA Standing paste 6mm SPST 200gf 12V SMD,6x6mm Tactile Switches ROHS; Manufacturer: ITT C&K; Contact Resistance: 100mR; Number of Positions: 2NUMBER; Supplier: Digikey; Supplier Part Number: CKN9085CT-ND; Manufacturer Part Number: PTS645SH50SMTR92LFS; RoHS: Yes; Category: Tactile Switches; Stock: 26399; Pricing: 1=0.4, 10=0.325, 25=0.2992, 100=0.2639, 250=0.24264, 500=0.22758 (USD); Contact Current Rating: 50mA; Lead Free: 5697LeadFree; ComponentLink1URL: https://datasheet.ciiva.com/29903/getdatasheetpartid-773702-29903807.pdf?src-supplier=Verical; ComponentLink1Description: https://datasheet.ciiva.com/29903/getdatasheetpartid-773702-29903807.pdf?src-supplier=Verical; ComponentLink2URL: https://datasheet.ciiva.com/14920/pts645-14920741.pdf?src-supplier=Digikey; ComponentLink2Description: https://datasheet.ciiva.com/14920/pts645-14920741.pdf?src-supplier=Digikey; ComponentLink3URL: https://datasheet.ciiva.com/22637/1707731-22637356.pdf?src-supplier=Element14; ComponentLink3Description: https://datasheet.ciiva.com/22637/1707731-22637356.pdf?src-supplier=Element14; LCSC Part number: C221869
U1 = ESP32-S3-MINI-1-N8: SMD module, ESP32-S3FN8, 8 MB SPI flash, PCB antenna; Manufacturer: Espressif Systems; Supplier: Digikey; Supplier Part Number: 1965-ESP32-S3-MINI-1-N8CT-ND; Manufacturer Part Number: ESP32-S3-MINI-1-N8; RoHS: No; Category: LDO; Stock: 3722; Pricing: 1=3.1 (USD); ComponentLink1URL: https://datasheet.octopart.com/ESP32-S3-MINI-1-N8-Espressif-Systems-datasheet-165560562.pdf?src-supplier=TME; ComponentLink1Description: https://datasheet.octopart.com/ESP32-S3-MINI-1-N8-Espressif-Systems-datasheet-165560562.pdf?src-supplier=TME; LCSC Part number: C2913206
U2 = FT231XQ-R: USB to Full Handshake UART Interface QFN20 Reel (not offered in your region); Manufacturer: FTDI; Supplier: Digikey; Supplier Part Number: 768-1128-1-ND; Manufacturer Part Number: FT231XQ-R; RoHS: Yes; Category: Interface ICs; Stock: 45518; Pricing: 1=2.34, 25=2.27, 100=2.2, 250=2, 500=1.82002, 1000=1.7625 (USD); Height: 800um; Lead Free: 5697LeadFree; ComponentLink1URL: https://datasheet.ciiva.com/4787/ds-ft231x-13571-4787570.pdf?src-supplier=Mouser; ComponentLink1Description: https://datasheet.ciiva.com/4787/ds-ft231x-13571-4787570.pdf?src-supplier=Mouser; ComponentLink2URL: https://datasheet.ciiva.com/30475/0900766b811020d3-30475405.pdf?src-supplier=Rs; ComponentLink2Description: https://datasheet.ciiva.com/30475/0900766b811020d3-30475405.pdf?src-supplier=Rs; ComponentLink3URL: https://datasheet.ciiva.com/1787/ds-ft231x-1787312.pdf?src-supplier=Digikey; ComponentLink3Description: https://datasheet.ciiva.com/1787/ds-ft231x-1787312.pdf?src-supplier=Digikey; ComponentLink4URL: https://datasheet.ciiva.com/1787/ft-x-series-1787313.pdf?src-supplier=Digikey; ComponentLink4Description: https://datasheet.ciiva.com/1787/ft-x-series-1787313.pdf?src-supplier=Digikey; ComponentLink5URL: https://datasheet.ciiva.com/1787/ft-x-series-1787314.pdf?src-supplier=Digikey; ComponentLink5Description: https://datasheet.ciiva.com/1787/ft-x-series-1787314.pdf?src-supplier=Digikey; LCSC Part number: C132159
U3 = TL1963A-33DCYR: IC REG LINEAR 3.3V 1.5A SOT223-4; Manufacturer: Texas Instruments; Supplier: Digikey; Supplier Part Number: 296-24897-1-ND; Manufacturer Part Number: TL1963A-33DCYR; RoHS: Yes; Category: Voltage Regulators - Linear; Stock: 6096; Pricing: 1=2.77, 10=2.069, 25=1.8936, 100=1.7, 250=1.60772, 500=1.55212, 1000=1.50634 (USD); Thickness: 1.6mm; Lead Free: 5697LeadFree; ComponentLink1URL: https://datasheet.ciiva.com/2046/-2046068.pdf?src-supplier=Digikey; ComponentLink1Description: https://datasheet.ciiva.com/2046/-2046068.pdf?src-supplier=Digikey; LCSC Part number: C181262